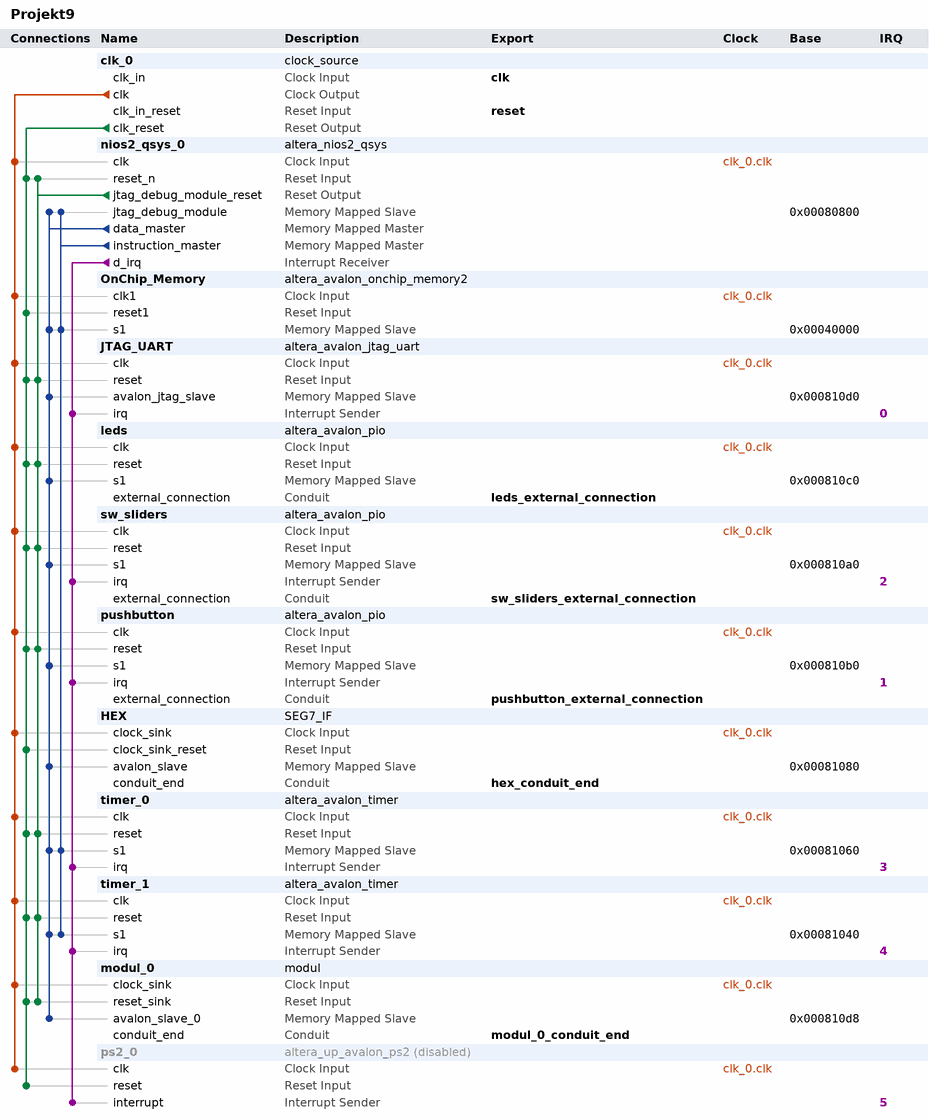
[diagram p0: system contents]
# Platform Designer (Qsys) system Projekt9, Cyclone V 5CGXFC7C7F23C8
# Parameters at their usual value, and those the tool derives, are not listed.
package require -exact qsys 17.0
create_system Projekt9
set_project_property DEVICE_FAMILY {Cyclone V}
set_project_property DEVICE 5CGXFC7C7F23C8

add_instance clk_0 clock_source 17.0
set_instance_parameter_value clk_0 clockFrequency 50000000

add_instance nios2_qsys_0 altera_nios2_qsys 16.1
set_instance_parameter_value nios2_qsys_0 breakSlave nios2_qsys_0.jtag_debug_module
set_instance_parameter_value nios2_qsys_0 exceptionSlave OnChip_Memory.s1
set_instance_parameter_value nios2_qsys_0 icache_size 4096
set_instance_parameter_value nios2_qsys_0 impl Tiny
set_instance_parameter_value nios2_qsys_0 mmu_TLBMissExcSlave None
set_instance_parameter_value nios2_qsys_0 resetSlave OnChip_Memory.s1
set_instance_parameter_value nios2_qsys_0 resetrequest_enabled true

add_instance OnChip_Memory altera_avalon_onchip_memory2 17.0
set_instance_parameter_value OnChip_Memory dataWidth 32
set_instance_parameter_value OnChip_Memory dualPort false
set_instance_parameter_value OnChip_Memory initMemContent true
set_instance_parameter_value OnChip_Memory initializationFileName onchip_mem.hex
set_instance_parameter_value OnChip_Memory memorySize 256000

add_instance JTAG_UART altera_avalon_jtag_uart 17.0
set_instance_parameter_value JTAG_UART simInteractiveOptions NO_INTERACTIVE_WINDOWS

add_instance leds altera_avalon_pio 17.0
set_instance_parameter_value leds direction Output
set_instance_parameter_value leds width 10

add_instance sw_sliders altera_avalon_pio 17.0
set_instance_parameter_value sw_sliders captureEdge true
set_instance_parameter_value sw_sliders direction Input
set_instance_parameter_value sw_sliders generateIRQ true
set_instance_parameter_value sw_sliders irqType EDGE
set_instance_parameter_value sw_sliders width 10

add_instance pushbutton altera_avalon_pio 17.0
set_instance_parameter_value pushbutton bitClearingEdgeCapReg true
set_instance_parameter_value pushbutton captureEdge true
set_instance_parameter_value pushbutton direction Input
set_instance_parameter_value pushbutton generateIRQ true
set_instance_parameter_value pushbutton irqType EDGE
set_instance_parameter_value pushbutton width 4

add_instance HEX SEG7_IF 1.0
set_instance_parameter_value HEX SEG7_NUM 6

add_instance timer_0 altera_avalon_timer 17.0
set_instance_parameter_value timer_0 period 1
set_instance_parameter_value timer_0 periodUnits MSEC

add_instance timer_1 altera_avalon_timer 17.0
set_instance_parameter_value timer_1 period 1
set_instance_parameter_value timer_1 periodUnits MSEC

add_instance modul_0 modul 1.0

add_instance ps2_0 altera_up_avalon_ps2 17.0
set_instance_property ps2_0 ENABLED false

# connections
add_connection clk_0.clk HEX.clock_sink clock
add_connection clk_0.clk JTAG_UART.clk clock
add_connection clk_0.clk leds.clk clock
add_connection clk_0.clk modul_0.clock_sink clock
add_connection clk_0.clk nios2_qsys_0.clk clock
add_connection clk_0.clk OnChip_Memory.clk1 clock
add_connection clk_0.clk ps2_0.clk clock
add_connection clk_0.clk pushbutton.clk clock
add_connection clk_0.clk sw_sliders.clk clock
add_connection clk_0.clk timer_0.clk clock
add_connection clk_0.clk timer_1.clk clock
add_connection clk_0.clk_reset HEX.clock_sink_reset reset
add_connection clk_0.clk_reset JTAG_UART.reset reset
add_connection clk_0.clk_reset leds.reset reset
add_connection clk_0.clk_reset modul_0.reset_sink reset
add_connection clk_0.clk_reset nios2_qsys_0.reset_n reset
add_connection clk_0.clk_reset OnChip_Memory.reset1 reset
add_connection clk_0.clk_reset ps2_0.reset reset
add_connection clk_0.clk_reset pushbutton.reset reset
add_connection clk_0.clk_reset sw_sliders.reset reset
add_connection clk_0.clk_reset timer_0.reset reset
add_connection clk_0.clk_reset timer_1.reset reset
add_connection nios2_qsys_0.jtag_debug_module_reset JTAG_UART.reset reset
add_connection nios2_qsys_0.jtag_debug_module_reset leds.reset reset
add_connection nios2_qsys_0.jtag_debug_module_reset modul_0.reset_sink reset
add_connection nios2_qsys_0.jtag_debug_module_reset nios2_qsys_0.reset_n reset
add_connection nios2_qsys_0.jtag_debug_module_reset pushbutton.reset reset
add_connection nios2_qsys_0.jtag_debug_module_reset sw_sliders.reset reset
add_connection nios2_qsys_0.jtag_debug_module_reset timer_0.reset reset
add_connection nios2_qsys_0.jtag_debug_module_reset timer_1.reset reset
add_connection nios2_qsys_0.data_master HEX.avalon_slave avalon
set_connection_parameter_value nios2_qsys_0.data_master/HEX.avalon_slave baseAddress 0x00081080
add_connection nios2_qsys_0.data_master JTAG_UART.avalon_jtag_slave avalon
set_connection_parameter_value nios2_qsys_0.data_master/JTAG_UART.avalon_jtag_slave baseAddress 0x000810d0
add_connection nios2_qsys_0.data_master leds.s1 avalon
set_connection_parameter_value nios2_qsys_0.data_master/leds.s1 baseAddress 0x000810c0
add_connection nios2_qsys_0.data_master modul_0.avalon_slave_0 avalon
set_connection_parameter_value nios2_qsys_0.data_master/modul_0.avalon_slave_0 baseAddress 0x000810d8
add_connection nios2_qsys_0.data_master nios2_qsys_0.jtag_debug_module avalon
set_connection_parameter_value nios2_qsys_0.data_master/nios2_qsys_0.jtag_debug_module baseAddress 0x00080800
add_connection nios2_qsys_0.data_master OnChip_Memory.s1 avalon
set_connection_parameter_value nios2_qsys_0.data_master/OnChip_Memory.s1 baseAddress 0x00040000
add_connection nios2_qsys_0.data_master pushbutton.s1 avalon
set_connection_parameter_value nios2_qsys_0.data_master/pushbutton.s1 baseAddress 0x000810b0
add_connection nios2_qsys_0.data_master sw_sliders.s1 avalon
set_connection_parameter_value nios2_qsys_0.data_master/sw_sliders.s1 baseAddress 0x000810a0
add_connection nios2_qsys_0.data_master timer_0.s1 avalon
set_connection_parameter_value nios2_qsys_0.data_master/timer_0.s1 baseAddress 0x00081060
add_connection nios2_qsys_0.data_master timer_1.s1 avalon
set_connection_parameter_value nios2_qsys_0.data_master/timer_1.s1 baseAddress 0x00081040
add_connection nios2_qsys_0.instruction_master nios2_qsys_0.jtag_debug_module avalon
set_connection_parameter_value nios2_qsys_0.instruction_master/nios2_qsys_0.jtag_debug_module baseAddress 0x00080800
add_connection nios2_qsys_0.instruction_master OnChip_Memory.s1 avalon
set_connection_parameter_value nios2_qsys_0.instruction_master/OnChip_Memory.s1 baseAddress 0x00040000
add_connection nios2_qsys_0.instruction_master timer_0.s1 avalon
set_connection_parameter_value nios2_qsys_0.instruction_master/timer_0.s1 baseAddress 0x00081060
add_connection nios2_qsys_0.instruction_master timer_1.s1 avalon
set_connection_parameter_value nios2_qsys_0.instruction_master/timer_1.s1 baseAddress 0x00081040
add_connection nios2_qsys_0.d_irq JTAG_UART.irq interrupt
set_connection_parameter_value nios2_qsys_0.d_irq/JTAG_UART.irq irqNumber 0
add_connection nios2_qsys_0.d_irq ps2_0.interrupt interrupt
set_connection_parameter_value nios2_qsys_0.d_irq/ps2_0.interrupt irqNumber 5
add_connection nios2_qsys_0.d_irq pushbutton.irq interrupt
set_connection_parameter_value nios2_qsys_0.d_irq/pushbutton.irq irqNumber 1
add_connection nios2_qsys_0.d_irq sw_sliders.irq interrupt
set_connection_parameter_value nios2_qsys_0.d_irq/sw_sliders.irq irqNumber 2
add_connection nios2_qsys_0.d_irq timer_0.irq interrupt
set_connection_parameter_value nios2_qsys_0.d_irq/timer_0.irq irqNumber 3
add_connection nios2_qsys_0.d_irq timer_1.irq interrupt
set_connection_parameter_value nios2_qsys_0.d_irq/timer_1.irq irqNumber 4

# exported interfaces
add_interface clk clock sink
set_interface_property clk EXPORT_OF clk_0.clk_in
add_interface hex_conduit_end conduit end
set_interface_property hex_conduit_end EXPORT_OF HEX.conduit_end
add_interface leds_external_connection conduit end
set_interface_property leds_external_connection EXPORT_OF leds.external_connection
add_interface modul_0_conduit_end conduit end
set_interface_property modul_0_conduit_end EXPORT_OF modul_0.conduit_end
add_interface pushbutton_external_connection conduit end
set_interface_property pushbutton_external_connection EXPORT_OF pushbutton.external_connection
add_interface reset reset sink
set_interface_property reset EXPORT_OF clk_0.clk_in_reset
add_interface sw_sliders_external_connection conduit end
set_interface_property sw_sliders_external_connection EXPORT_OF sw_sliders.external_connection

set_interconnect_requirement {$system} qsys_mm.clockCrossingAdapter HANDSHAKE
set_interconnect_requirement {$system} qsys_mm.enableEccProtection FALSE
set_interconnect_requirement {$system} qsys_mm.insertDefaultSlave FALSE
set_interconnect_requirement {$system} qsys_mm.maxAdditionalLatency 1

save_system Projekt9.qsys
